# EAGLE schematic Prototype1_Draft1_Schematic (EAGLE 9.6.2)
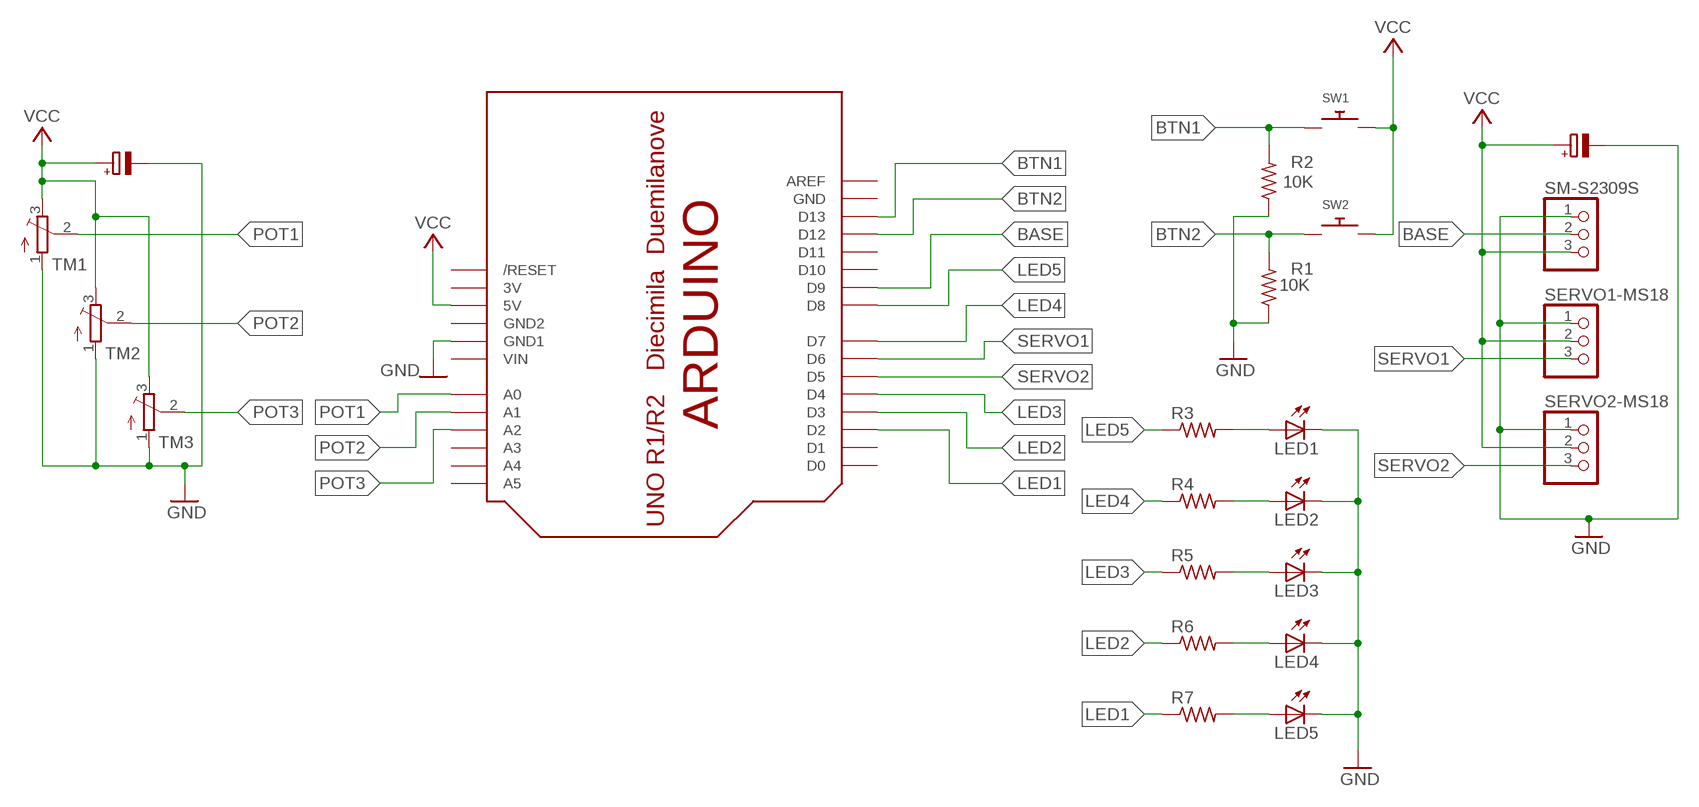
[diagram p0: schematic, sheet 1]

## Parts
LED1  LED3MM  [LED3MM]
LED2  LED3MM  [LED3MM]
LED3  LED3MM  [LED3MM]
LED4  LED3MM  [LED3MM]
LED5  LED3MM  [LED3MM]
R1  10K  R-US_0204/5  [0204/5]
R2  10K  R-US_0204/5  [0204/5]
R3  R-US_0204/5  [0204/5]
R4  R-US_0204/5  [0204/5]
R5  R-US_0204/5  [0204/5]
R6  R-US_0204/5  [0204/5]
R7  R-US_0204/5  [0204/5]
SERVO1-MS18  PINHD-1X3  [1X03]
SERVO2-MS18  PINHD-1X3  [1X03]
SM-S2309S  PINHD-1X3  [1X03]
SW1  SWITCH_PUSHBUTTONEVQ-PE  [TACT_PANA-EVQ]
SW2  SWITCH_PUSHBUTTONEVQ-PE  [TACT_PANA-EVQ]
TM1  TRIMPOTTC33X  [TC33X]
TM2  TRIMPOTTC33X  [TC33X]
TM3  TRIMPOTTC33X  [TC33X]
U$1  ARDUINO-BPLACE  [ARDUINO-BPLACE]

## Nets
BASE: SM-S2309S.2 U$1.D9
BTN1: R2.2 SW1.P$1 U$1.D13
BTN2: R1.2 SW2.P$1 U$1.D12
GND: LED1.K(C) LED2.K(C) LED3.K(C) LED4.K(C) LED5.K(C) R1.1 R2.1 SERVO1-MS18.1 SERVO2-MS18.1 SM-S2309S.1 TM1.1(A) TM2.1(A) TM3.1(A) U$1.GND1
LED1: R7.1 U$1.D2
LED2: R6.1 U$1.D3
LED3: R5.1 U$1.D4
LED4: R4.1 U$1.D7
LED5: R3.1 U$1.D8
N$9: LED1.A R3.2
N$11: LED2.A R4.2
N$14: LED3.A R5.2
N$15: LED4.A R6.2
N$16: LED5.A R7.2
POT1: TM1.2(S) U$1.A0
POT2: TM2.2(S) U$1.A1
POT3: TM3.2(S) U$1.A2
SERVO1: SERVO1-MS18.3 U$1.D6
SERVO2: SERVO2-MS18.3 U$1.D5
VCC: SERVO1-MS18.2 SERVO2-MS18.2 SM-S2309S.3 SW1.P$2 SW2.P$2 TM1.3(E) TM2.3(E) TM3.3(E) U$1.5V
Unconnected: U$1.A3 U$1.A4 U$1.A5 U$1.AREF U$1.D0 U$1.D1 U$1.D10 U$1.D11 U$1.RESET(/RESET)

## Power pins joined to a net without a drawn wire
3V: U$1.3V
GND: U$1.GND
GND2: U$1.GND2
VIN: U$1.VIN

## Library data of the parts
LED1-LED5 = adafruit:LED: LED OSRAM: - CHIPLED LG R971, LG N971, LY N971, LG Q971, LY Q971, LO R971, LY R971 LH N974, LH R974 LS Q976, LO Q976, LY Q976 LO Q996 - Hyper CHIPLED LW Q18S LB Q993, LB Q99A, LB R99A - SideLED LS A670, LO A670, LY A670, LG A670, LP A670 LB A673, LV A673, LT A673, LW A673 LH A674 LY A675 LS A676, LA A676, LO A676, LY A676, LW A676 LS A679, LY A679, LG A679 - Hyper Micro SIDELED® LS Y876, LA Y876, LO Y876, LY Y876 LT Y87S - SmartLED LW L88C, LW L88S LB L89C, LB L89S, LG L890 LS L89K, LO L89K, LY L89K LS L896, LA L896, LO L896, LY L896 - TOPLED LS T670, LO T670, LY T670, LG T670, LP T670 LSG T670, LSP T670, LSY T670, LOP T670, LYG T670 LG T671, LOG T671, LSG T671 LB T673, LV T673, LT T673, LW T673 LH T674 LS T676, LA T676, LO T676, LY T676, LB T676, LH T676, LSB T676, LW T676 LB T67C, LV T67C, LT T67C, LS T67K, LO T67K, LY T67K, LW E67C LS E67B, LA E67B, LO E67B, LY E67B, LB E67C, LV E67C, LT E67C LW T67C LS T679, LY T679, LG T679 LS T770, LO T770, LY T770, LG T770, LP T770 LB T773, LV T773, LT T773, LW T773 LH T774 LS E675, LA E675, LY E675, LS T675 LS T776, LA T776, LO T776, LY T776, LB T776 LHGB T686 LT T68C, LB T68C - Hyper Mini TOPLED® LB M676 - Mini TOPLED Santana® LG M470 LS M47K, LO M47K, LY M47K Source: http://www.osram.convergy.de/
R1-R7 = adafruit:R-US_: RESISTOR, American symbol
SERVO1-MS18 SERVO2-MS18 SM-S2309S = adafruit:PINHD-1X3: PIN HEADER
SW1 SW2 = adafruit:SWITCH_PUSHBUTTON: Buttons SOFTTOUCHSMD_SJ - Soft touch temporary push button (Super Junk Akihabara) Compatible with SKPMANE010 [Mouser: 688-SKPMAN] C&K_KSS = Digikey: KSS221GLFS
TM1-TM3 = adafruit:TRIMPOT: SMT trimmer potentiometer part number TC33X http://www.ladyada.net/library/eagle
U$1 = adafruit:ARDUINO: Arduino Diecimila/Duemilanove Make a shield with ease, this package has all the named pins as well as the two mounting drill holes and an outline of the USB and DC power connector. The outline is on the DIMENSION layer, so if your board house uses it they will cut the outline to match. http://www.ladyada.net/library/pcb/eaglelibrary.html